# Altium schematic sheet KDAT_Sch.SchDoc
size A; SheetNumber: 1; SheetTotal: 1
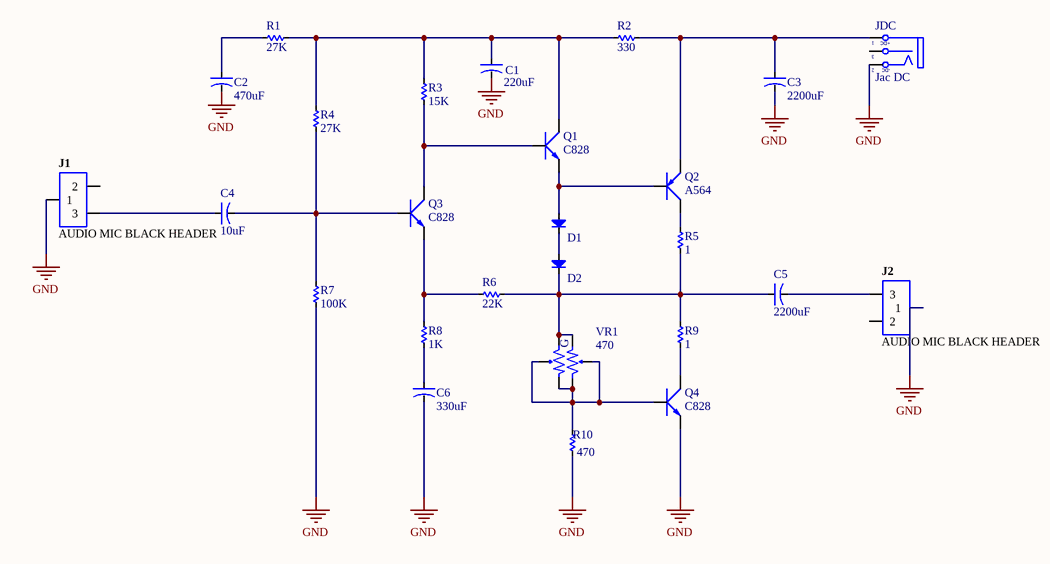
[diagram p0: KDAT_Sch.SchDoc]

## Parts
C1  220uF  [CA-ALU-6.3]
C2  470uF  [CA-ALU-6.3]
C3  2200uF  [CA-ALU-10]
C4  10uF  [CA-ALU-6.3]
C5  2200uF  [CA-ALU-10]
C6  330uF  [CA-ALU-6.3]
D1  1N4148  [DIO-0.5A-SMALL]  (value not drawn)
D2  1N4148  [DIO-0.5A-SMALL]  (value not drawn)
J1  AUDIO MIC BLACK HEADER  [CON MIC2]
J2  AUDIO MIC BLACK HEADER  [CON MIC2]
JDC  Jac DC  [DC0]
Q1  C828  [TO92-123]
Q2  A564  [TO92-123]
Q3  C828  [TO92-123]
Q4  C828  [TO92-123]
R1  27K  [RES-1/4WD]
R2  330  [RES-1/4WD]
R3  15K  [RES-1/4WD]
R4  27K  [RES-1/4WD]
R5  1  [RES-1/4WD]
R6  22K  [RES-1/4WD]
R7  100K  [RES-1/4WD]
R8  1K  [RES-1/4WD]
R9  1  [RES-1/4WD]
R10  470  [RES-1/4WD]
VR1  470  [VR-D1]

## Nets
GND: C1.2 C2.2 C3.2 C6.2 J1.1 J2.1 JDC.2(TN) Q4.1(E) R7.2 R10.1
NetC1_1: C1.1 Q1.3(C) R1.1 R2.1 R3.1 R4.1
NetC2_1: C2.1 R1.2
NetC3_1: C3.1 JDC.1(T) Q2.1(E) R2.2
NetC4_1: C4.1 J1.3
NetC4_2: C4.2 Q3.2(B) R4.2 R7.1
NetC5_1: C5.1 D2.2(K) R5.1 R6.2 R9.2 VR1.1 VR1.4
NetC5_2: C5.2 J2.3
NetC6_1: C6.1 R8.2
NetD1_1: D1.1(A) Q1.1(E) Q2.2(B)
NetD1_2: D1.2(K) D2.1(A)
NetQ1_2: Q1.2(B) Q3.3(C) R3.2
NetQ2_3: Q2.3(C) R5.2
NetQ3_1: Q3.1(E) R6.1 R8.1
NetQ4_2: Q4.2(B) R10.2 VR1.2 VR1.3 VR1.5 VR1.6
NetQ4_3: Q4.3(C) R9.1

Not connected (* = marked no-connect by the designer): J1 2; J2 2; JDC 3(S)

## Notes on the sheet
- (in symbol DCIN) +DC; -DC
- (in symbol VR-D) G

## Library data of the parts
C1-C6 = CN-ALU-DIP: Capacitor (Semiconductor SIM Model); Value: 104; LatestRevisionDate: 17-Jul-2002; LatestRevisionNote: Re-released for DXP Platform.; PackageReference: C1206; Publisher: Altium Limited
D1 D2 = Diode: Default Diode; Code - JEDEC: DO-214-AB; Value: 1N5007; Published: 8-Jun-2000; Revision: July-2002: Re-released for DXP Platform.; Publisher: Altium Limited
J1 J2 = CON MIC2: Connector, 3.5mm Stereo Audio Socket, Black, 2 break contacts (normals) and 2 auxiliary make contacts; Connector type: AUDIO BLACK HEADER; Category: Connector; Status: Production
JDC = DCIN: Jac DC input; Value: Jac DC
Q1 Q3 Q4 = 2N222: NPN 600mW, ECB; Value: C1815
Q2 = 2N3906: PNP 600mW, ECB; Value: A1015
R1-R10 = Res: Manufacturer: Generic Components; Class: Passive; SubClass: R; Published: 08/06/2000; Publisher: Altium Hobart Technology Centre
VR1 = VR-D: Volume control Dual; Value: Volume Dual 50K